# EAGLE design SN76477 Synth (EAGLE 9.5.2)
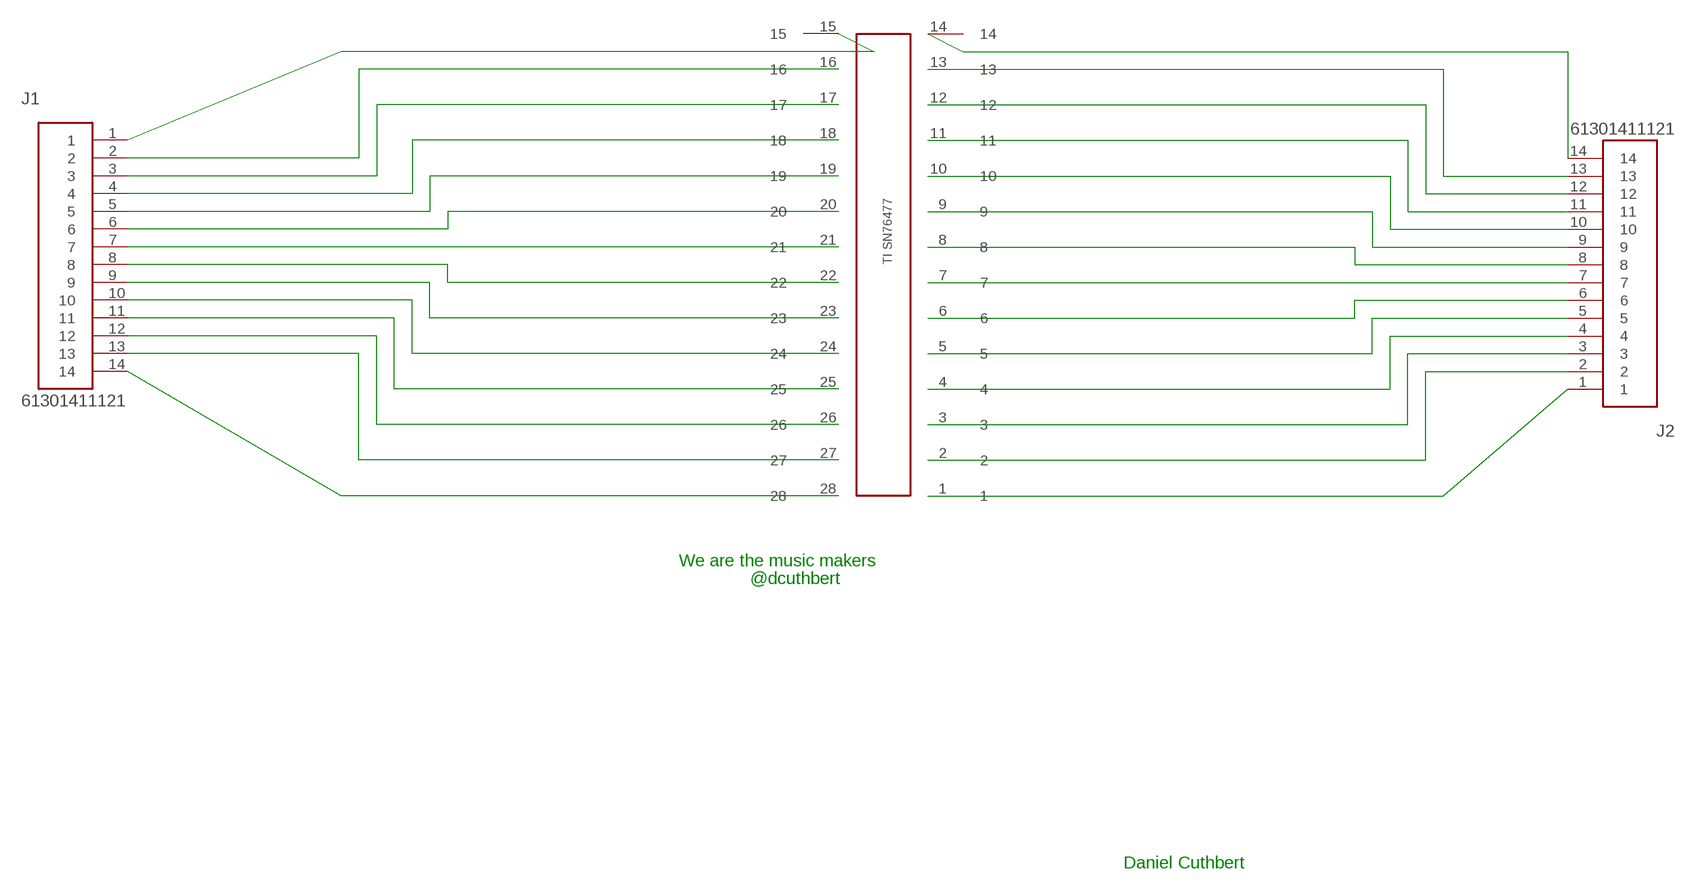
[diagram p0: schematic, sheet 1]

## Parts
J1  61301411121  [61301411121]
J2  61301411121  [61301411121]
U$1  SN76477NOISEGENERATORSN76477  [SN76477NOISEGENERATOR]

## Nets
N$1: J2.1 U$1.1
N$2: J2.2 U$1.2
N$3: J2.3 U$1.3
N$4: J2.4 U$1.4
N$5: J2.5 U$1.5
N$6: J2.6 U$1.6
N$7: J2.7 U$1.7
N$8: J2.8 U$1.8
N$9: J2.9 U$1.9
N$10: J2.10 U$1.10
N$11: J2.11 U$1.11
N$12: J2.12 U$1.12
N$13: J2.13 U$1.13
N$14: J2.14 U$1.14
N$15: J1.1 U$1.15
N$16: J1.14 U$1.28
N$17: J1.2 U$1.16
N$18: J1.13 U$1.27
N$19: J1.12 U$1.26
N$20: J1.11 U$1.25
N$21: J1.10 U$1.24
N$22: J1.9 U$1.23
N$23: J1.8 U$1.22
N$24: J1.7 U$1.21
N$25: J1.6 U$1.20
N$26: J1.5 U$1.19
N$27: J1.4 U$1.18
N$28: J1.3 U$1.17

## Notes on the sheet
- We are the music makers
- @dcuthbert
- Daniel Cuthbert

## Library data of the parts
J1 J2 = Headers:61301411121: CONN HEADER VERT 14POS 2.54MM Manufacturer's datasheet <https://katalog.we-online.de/em/datasheet/6130xx11121.pdf>; CREATED_BY: PCBLayout.com; DIGIKEY_PART_NUMBER: 732-5325-ND; MANUFACTURER: Wurth Electronics Inc.; MPN: 61301411121
U$1 = SN74677:SN76477NOISEGENERATOR: The SN76477 is a complex sound generator in the form of a monolithic chip. It rocks. Loved Space Invaders? well then you've had the pleasure of listening to the SN76477. The SN76477 generates complex audio signal waveforms by combining the outputs of a low frequency oscillator, variable frequency (voltage controlled) oscillator (VCO) and noise source, modulating the resulting composite signal with a selected envelope and, finally, adjusting the signal's attack and decay periods. At each stage, the process can be controlled at the programming inputs of the signal modification and generation circuits, using control voltages, logic levels, or different resistor and capacitor values. SN76477 PIN FUNCTIONS AND COMPONENT VALUES Make Magazine <https://makezine.com/projects/space-invaders-synthesizer/> kindly made this list, thank you! 1. Logic input. Applies a sound envelope in conjunction with pin 28. 2. Negative ground. 3. External clock input for noise generator (optional). Maximum 10V. 4. Closing the switch enables the internal noise clock. The 47K resistor may be increased up to 100K to get a lower-frequency noise. 5. Low-pass noise filter adjustment. 6. Low-pass noise filter range. 7. Decay activation switch and adjustment. Determines the discharge time of the attack/decay range capacitor applied to pin 8. Open switch causes instant-off (no decay time). 8. Attack/decay range. 9. Logic input. Logic high inhibits sound output, logic low (or open switch) enables sound, and high-low transition with the pushbutton triggers the one-shot function. If the input goes high during a sound, the sound will be interrupted. Envelope selection pin 1 must be high and pin 28 must be low for the one-shot to work. 10. Attack activation switch and adjustment. Determines the charge time of the attack/decay range capacitor applied to pin 8. Open switch causes instant-on (no attack time). 11. Audio output level. 12. Feedback from amplifier output. 13. Amplifier output to base of transistor. 14. 9VDC power input. Also supplies collector of transistor. 15. 5VDC power input if pin 14 is unconnected, or 5VDC power output if 9VDC is applied to pin 14. 16. External VCO input, or internal VCO adjustment. Maximum range of external source: 0V to 2.35V. Exceeding this range saturates the audio output and causes distortion. 17. VCO range. 18. VCO activation switch and adjustment. 19. Pitch adjustment via pulse-width modulation of the VCO output. Leaving the switch open gives a 50% duty cycle of the VCO. 20. Super-low-frequency oscillator activation switch and adjustment. 21. Super-low-frequency oscillator range. 22. Logic input. Logic high controls VCO with internal capacitors, logic low selects external control with pin 16. 23. One-shot duration range. 24. One-shot duration adjustment. 25. Logic input. Logic high selects Mixer B. 26. Logic input. Logic high selects Mixer A. 27. Logic input. Logic high selects Mixer C. 28. Logic input. Applies a sound envelope in conjunction with pin 1. The mixing of sound sources is controlled by the logic states of pins 25, 26, and 27. After setting an envelope for your sound (i.e. attack, sustain, and decay) you decide how to apply it by setting logic states of pins 1 and 28. Have fun and make music.

## Board
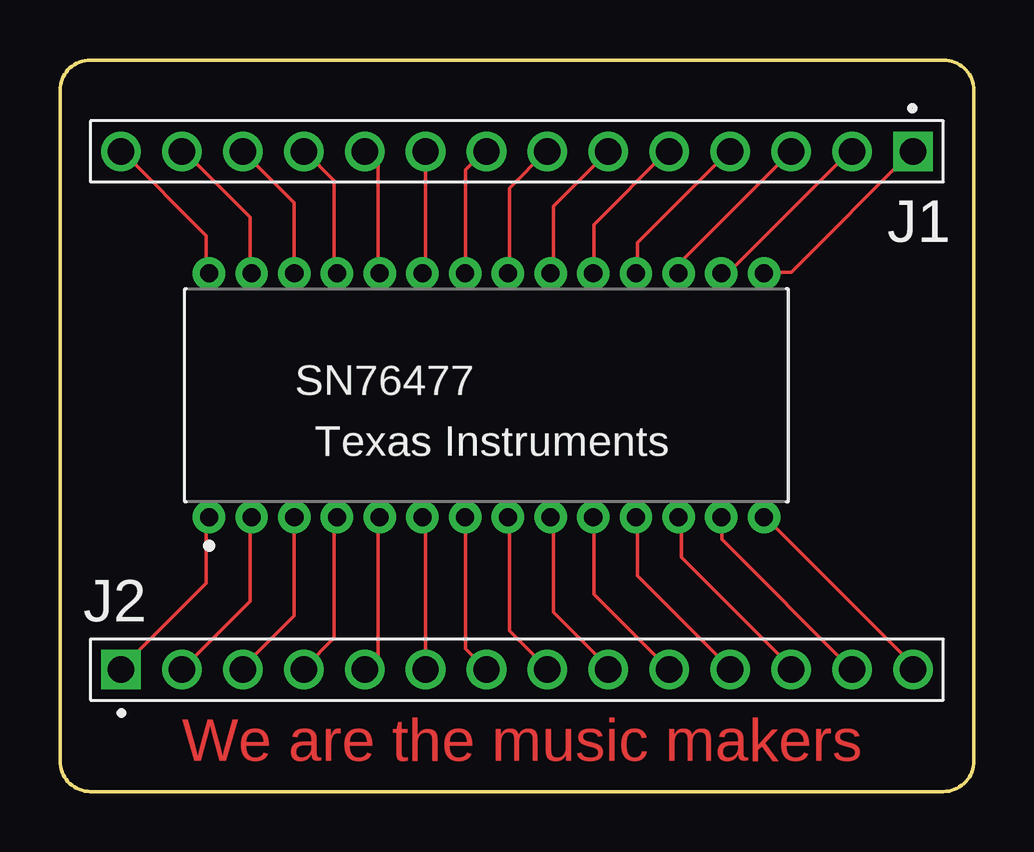
[diagram p1: board, top side]

Size 38.1 x 30.48 mm. Coordinates in mm from the lower left corner, seen from the top.
Outline: 36.83,0 1.27,0 arc-90 0,1.27 0,29.21 arc-90 1.27,30.48 36.83,30.48 arc-90 38.1,29.21 38.1,1.27 arc-90 36.83,0
Copper layers (1*16): Top 0.035mm / dielectric 1.5mm / Bottom 0.035mm
Design rules "default": minimum track width 6mil, minimum drill 0.35mm, track to track 6mil, track to pad 6mil, pad to pad 6mil, via to via 6mil, smd to smd 6mil, copper to edge 40mil, drill to drill 6mil, minimum pad ring 10mil, minimum via ring 8mil, stop-mask expansion 4mil, vias tented up to drill 0mil, thermal gap 10mil

### Footprints (pad centres in the part's own frame; a part is rotated, then mirrored left to right if it is on the bottom)
61301411121 = drill 1.1 square: 1 -16.51,0 | drill 1.1: 2 -13.97,0; 3 -11.43,0; 4 -8.89,0; 5 -6.35,0; 6 -3.81,0; 7 -1.27,0; 8 1.27,0; 9 3.81,0; 10 6.35,0; 11 8.89,0; 12 11.43,0; 13 13.97,0; 14 16.51,0
SN76477NOISEGENERATOR = drill 0.753 pad 1.353: 1 -5.08,11.57; 2 -5.08,9.79; 3 -5.08,8.01; 4 -5.08,6.23; 5 -5.08,4.45; 6 -5.08,2.67; 7 -5.08,0.89; 8 -5.08,-0.89; 9 -5.08,-2.67; 10 -5.08,-4.45; 11 -5.08,-6.23; 12 -5.08,-8.01; 13 -5.08,-9.79; 14 -5.08,-11.57; 15 5.08,-11.57; 16 5.08,-9.79; 17 5.08,-8.01; 18 5.08,-6.23; 19 5.08,-4.45; 20 5.08,-2.67; 21 5.08,-0.89; 22 5.08,0.89; 23 5.08,2.67; 24 5.08,4.45; 25 5.08,6.23; 26 5.08,8.01; 27 5.08,9.79; 28 5.08,11.57

### Placement (x,y rotation side)
J1  19.05,26.67 180 top
J2  19.05,5.08 0 top
U$1  17.78,16.51 90 top

### Tracks (layer width: path | path; a pad name or v marks a point on that pad's centre or on a via)
N$1
  Top 0.152: U$1.1 6.1,11.43 6.1,8.69 2.59,5.18 J2.1
N$2
  Top 0.152: J2.2 7.92,7.92 7.92,11.43 U$1.2
N$3
  Top 0.152: U$1.3 9.75,11.43 9.75,7.32 7.62,5.18 J2.3
N$4
  Top 0.152: U$1.4 11.43,11.43 11.43,6.4 10.21,5.18 J2.4
N$5
  Top 0.152: J2.5 13.26,5.64 13.26,11.43 U$1.5
N$6
  Top 0.152: J2.6 15.24,11.43 U$1.6
N$7
  Top 0.152: J2.7 16.92,5.94 16.92,11.43 U$1.7
N$8
  Top 0.152: U$1.8 18.75,11.43 18.75,6.71 20.27,5.18 J2.8
N$9
  Top 0.152: U$1.9 20.57,11.43 20.57,7.47 22.86,5.18 J2.9
N$10
  Top 0.152: J2.10 22.25,8.23 22.25,11.43 U$1.10
N$11
  Top 0.152: U$1.11 24.08,11.43 24.08,8.99 27.89,5.18 J2.11
N$12
  Top 0.152: U$1.12 25.91,11.43 25.91,9.75 30.48,5.18 J2.12
N$13
  Top 0.152: J2.13 27.58,10.52 27.58,11.43 U$1.13
N$14
  Top 0.152: U$1.14 29.41,11.43 35.66,5.18 J2.14
N$15
  Top 0.152: U$1.15 29.41,21.64 30.48,21.64 35.51,26.67 J1.1
N$16
  Top 0.152: U$1.28 6.1,21.64 6.1,23.16 2.59,26.67 J1.14
N$17
  Top 0.152: U$1.16 27.58,21.64 27.89,21.64 32.92,26.67 J1.2
N$18
  Top 0.152: U$1.27 7.92,21.64 7.92,23.93 5.18,26.67 J1.13
N$19
  Top 0.152: J1.12 9.75,24.54 9.75,21.64 U$1.26
N$20
  Top 0.152: U$1.25 11.43,21.64 11.43,25.45 10.21,26.67 J1.11
N$21
  Top 0.152: U$1.24 13.26,21.64 13.26,26.21 12.8,26.67 J1.10
N$22
  Top 0.152: J1.9 15.24,21.64 U$1.23
N$23
  Top 0.152: U$1.22 16.92,21.64 16.92,25.91 17.68,26.67 J1.8
N$24
  Top 0.152: U$1.21 18.75,21.64 18.75,25.15 20.27,26.67 J1.7
N$25
  Top 0.152: J1.6 20.57,24.38 20.57,21.64 U$1.20
N$26
  Top 0.152: U$1.19 22.25,21.64 22.25,23.62 25.3,26.67 J1.5
N$27
  Top 0.152: U$1.18 24.08,21.64 24.08,22.86 27.89,26.67 J1.4
N$28
  Top 0.152: J1.3 25.91,22.1 25.91,21.64 U$1.17

### Text on the board
Top: We are the music makers